# Altium schematic sheet bme_affect_sen_brd.SchDoc
size A4
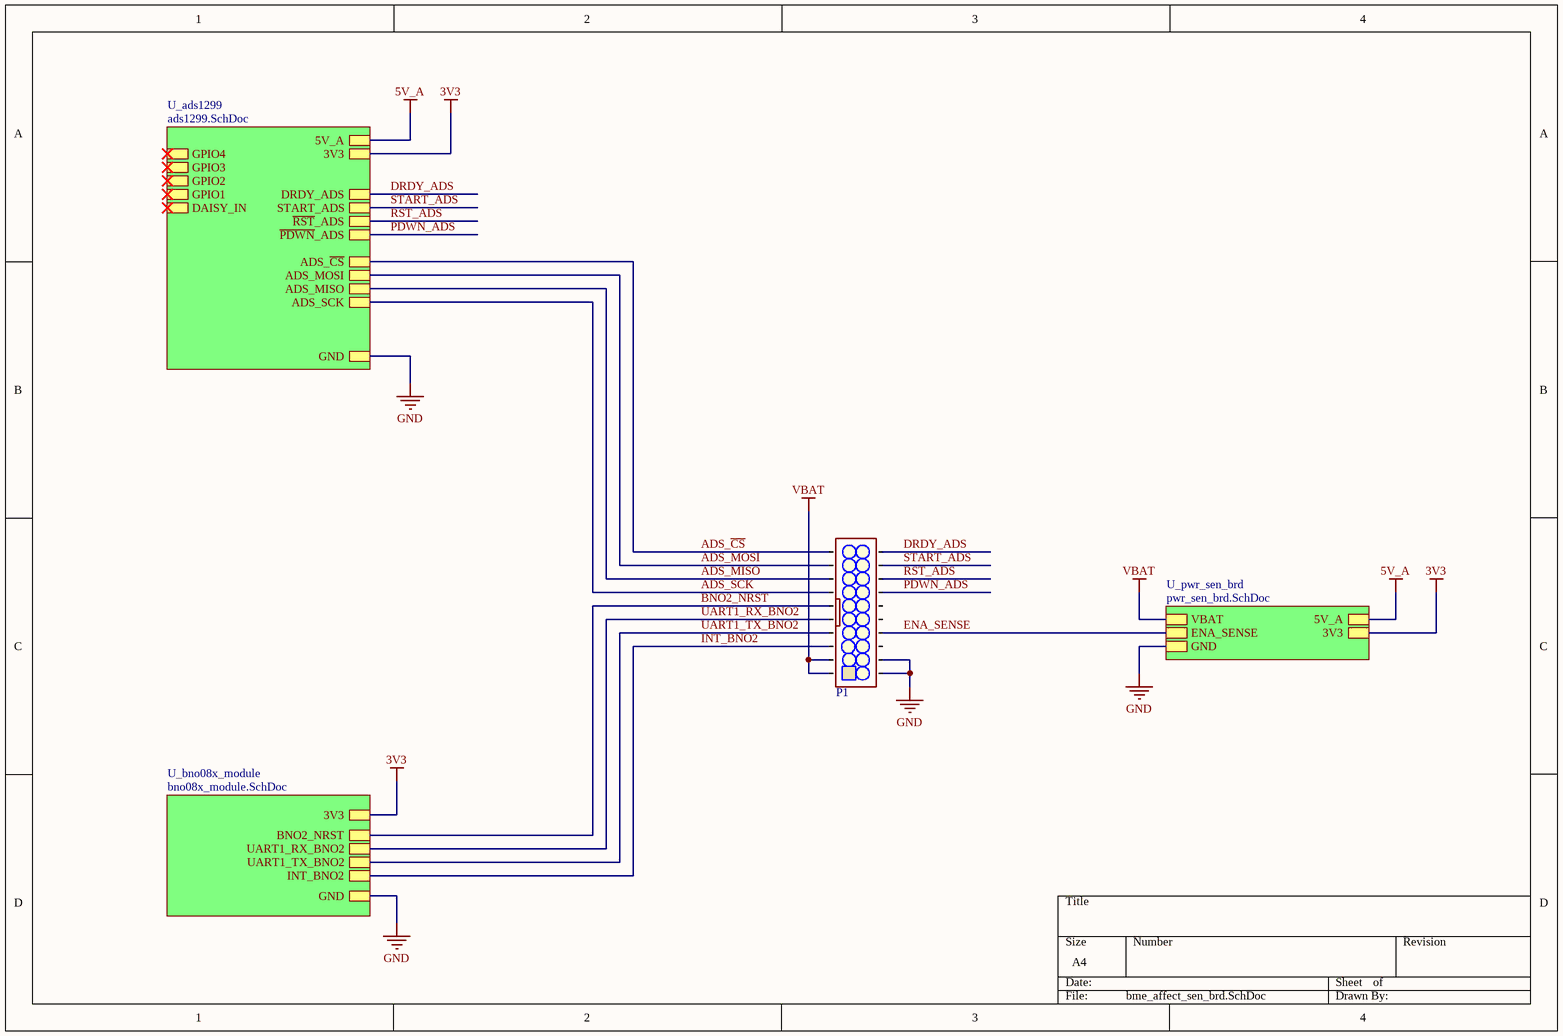
[diagram p0: bme_affect_sen_brd.SchDoc]

## Parts
P1  2x10 Ribbon Header  [2x10_RIBBON_CABLE_CON]  (value not drawn)

## Sub-sheets
U_ads1299 = ads1299.SchDoc: DRDY_ADS, GPIO4, GPIO2, GPIO3, START_ADS, GPIO1, DAISY_IN, 3V3, 5V_A, GND, ~{RST}_ADS, ~{PDWN}_ADS, ADS_~{CS}, ADS_MOSI, ADS_MISO, ADS_SCK
U_bno08x_module = bno08x_module.SchDoc: 3V3, GND, BNO2_NRST, UART1_RX_BNO2, UART1_TX_BNO2, INT_BNO2
U_pwr_sen_brd = pwr_sen_brd.SchDoc: 5V_A, VBAT, GND, 3V3, ENA_SENSE

## Nets
3V3: sheet U_ads1299/3V3, sheet U_pwr_sen_brd/3V3, sheet U_bno08x_module/3V3
5V_A: sheet U_ads1299/5V_A, sheet U_pwr_sen_brd/5V_A
GND: P1.19 P1.20 ; sheet U_ads1299/GND, sheet U_pwr_sen_brd/GND, sheet U_bno08x_module/GND
VBAT: P1.1 P1.2 ; sheet U_pwr_sen_brd/VBAT
ADS_~{CS}: P1.10 ; sheet U_ads1299/ADS_~{CS}
ADS_MISO: P1.8 ; sheet U_ads1299/ADS_MISO
ADS_MOSI: P1.9 ; sheet U_ads1299/ADS_MOSI
ADS_SCK: P1.7 ; sheet U_ads1299/ADS_SCK
BNO2_NRST: P1.6 ; sheet U_bno08x_module/BNO2_NRST
DRDY_ADS: P1.11 ; sheet U_ads1299/DRDY_ADS
ENA_SENSE: P1.17 ; sheet U_pwr_sen_brd/ENA_SENSE
INT_BNO2: P1.3 ; sheet U_bno08x_module/INT_BNO2
~{PDWN}_ADS: P1.14 ; sheet U_ads1299/~{PDWN}_ADS
~{RST}_ADS: P1.13 ; sheet U_ads1299/~{RST}_ADS
START_ADS: P1.12 ; sheet U_ads1299/START_ADS
UART1_RX_BNO2: P1.5 ; sheet U_bno08x_module/UART1_RX_BNO2
UART1_TX_BNO2: P1.4 ; sheet U_bno08x_module/UART1_TX_BNO2

Not connected (* = marked no-connect by the designer): P1 15 16 18

## Library data of the parts
P1 = 2x10 Ribbon Header: 2.54 mm; Manufacturer Part No: 302-S201; Value: 2x10 Pin Header